# Altium schematic sheet MagneticPowerSwitch.SchDoc: Magnetic Switch Logic
size 431 x 279 mm; DocumentNumber: 3; SheetNumber: 3; SheetTotal: 18; ENG_APP_DATE: --/--/--; DSN_APP_DATE: --/--/--; CHK_APP_DATE: --/--/--
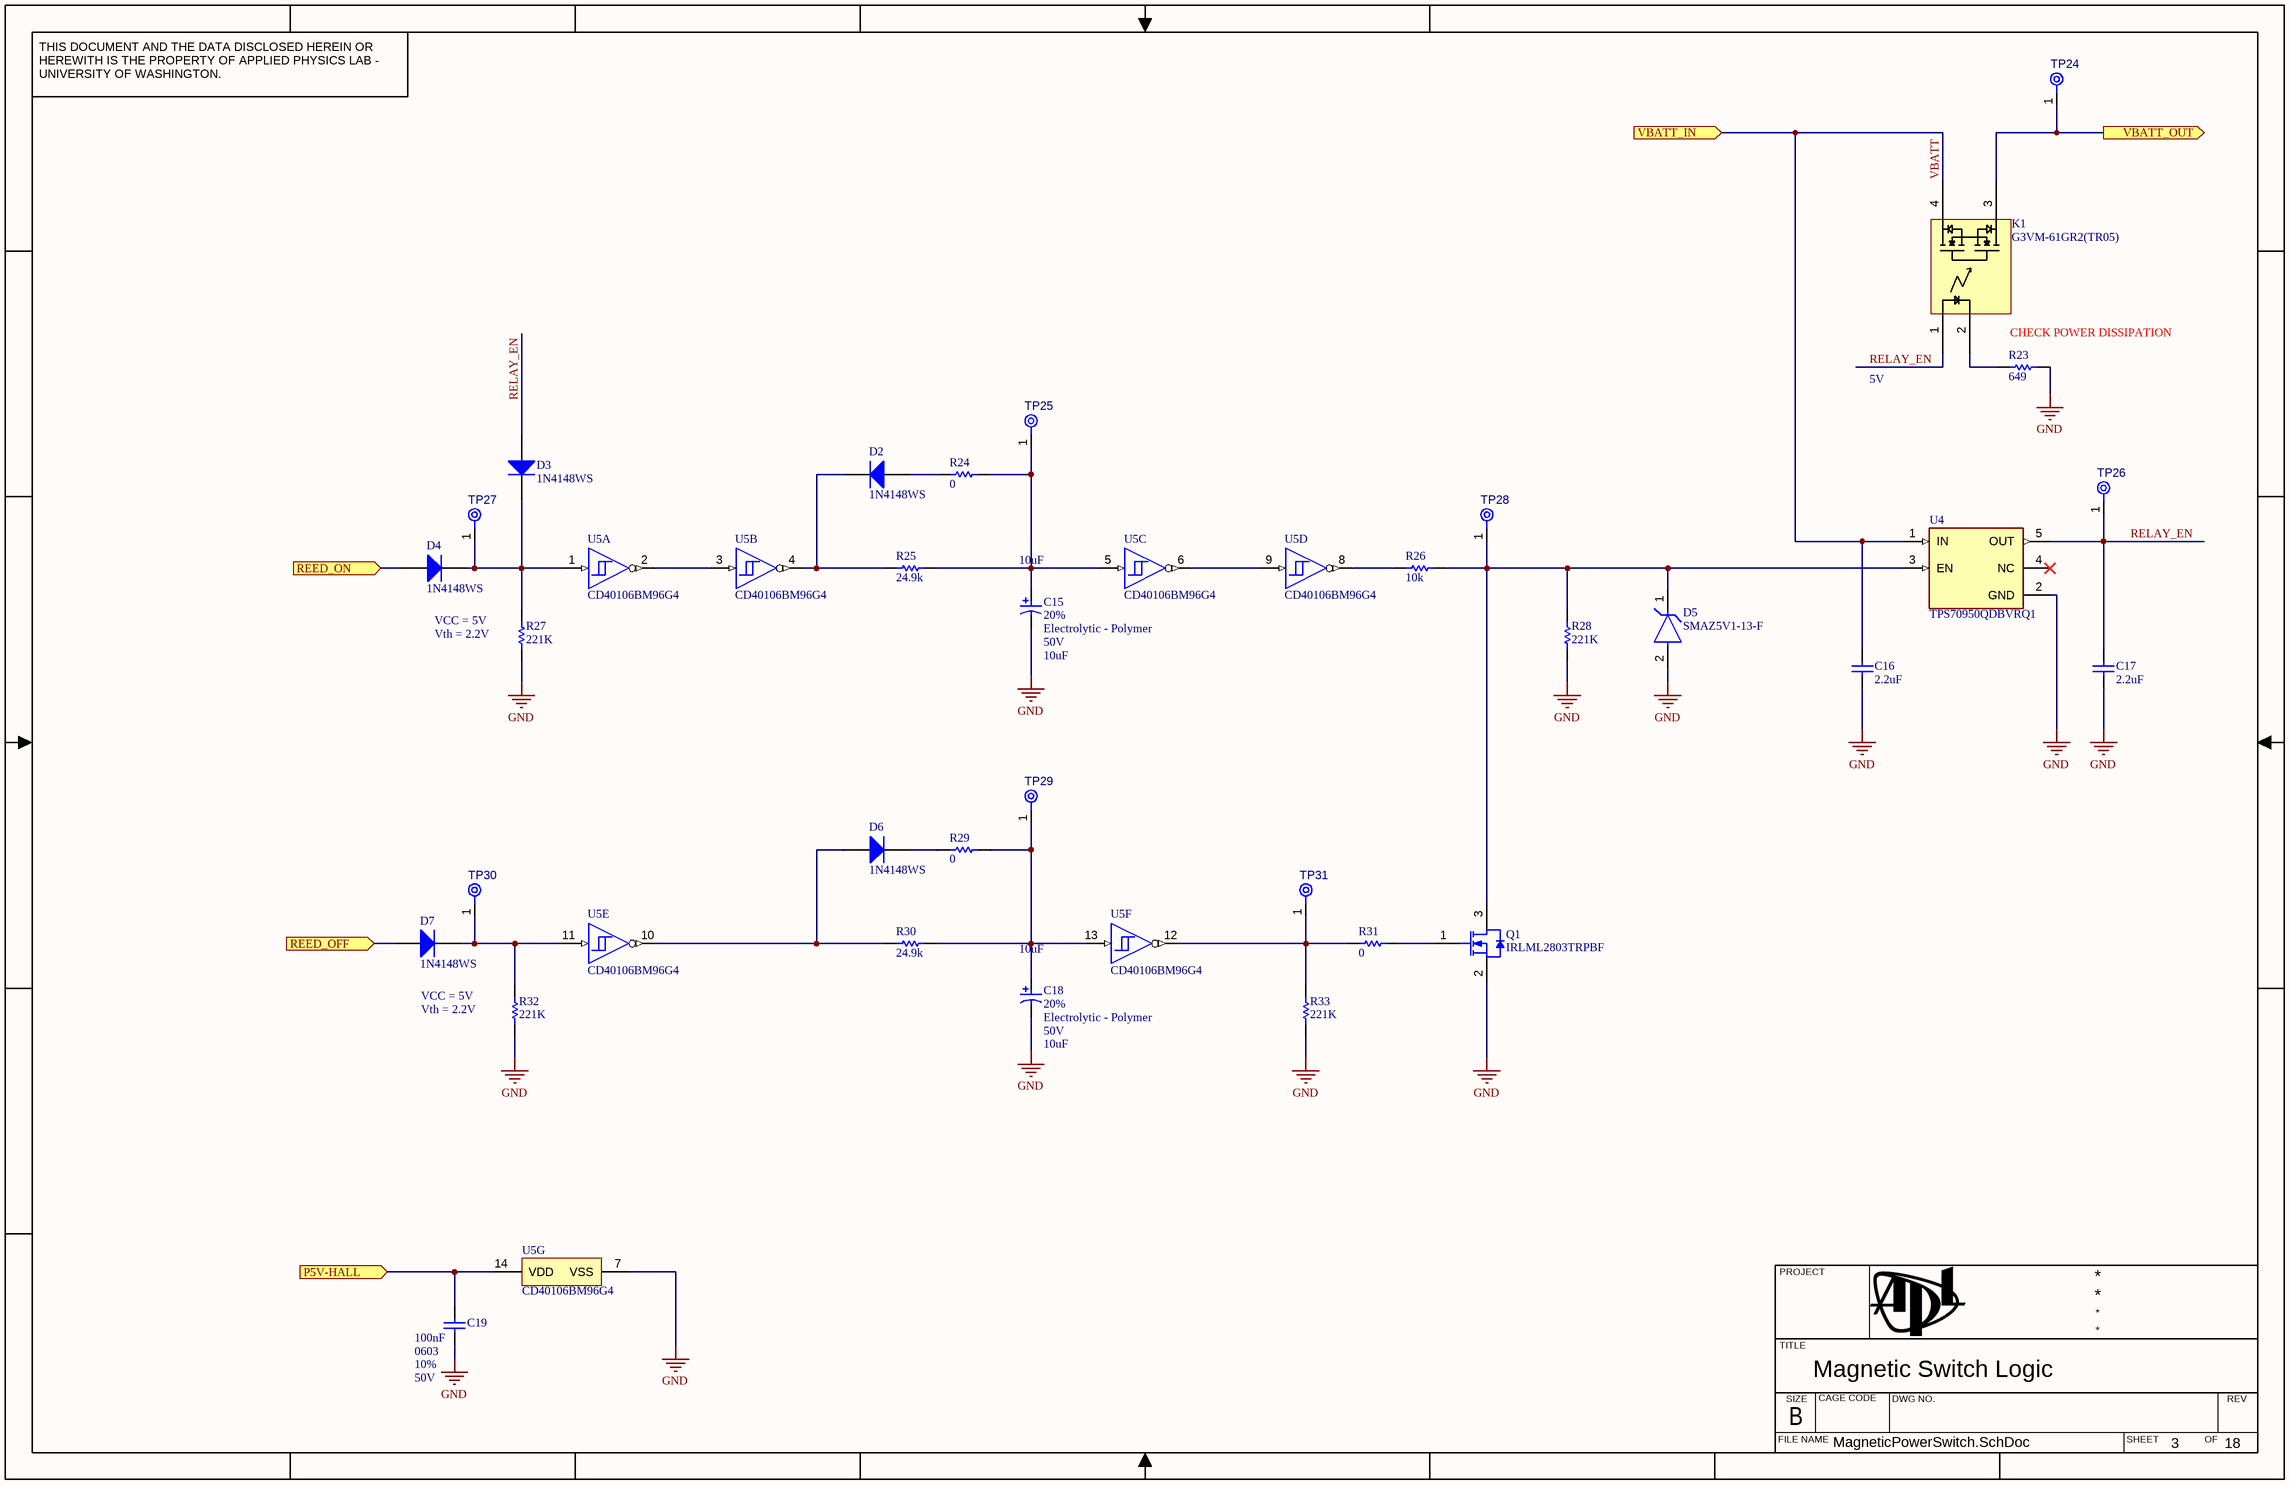
[diagram p0: MagneticPowerSwitch.SchDoc]

## Parts
C15  value 10uF  Tolerance: 20%  Material: Electrolytic - Polymer  Voltage Rating: 50V  Capacitance: 10uF  [CAPAE5953X61M]  (hidden comment: EEH-ZA1H100R)
C16  value 2.2uF  [CAPC3225X270X30ML30]  (hidden comment: Capacitor 2.2uF 10%, 50V, X7R, 1210)
C17  value 2.2uF  [CAPC3225X270X30ML30]  (hidden comment: Capacitor 2.2uF 10%, 50V, X7R, 1210)
C18  value 10uF  Tolerance: 20%  Material: Electrolytic - Polymer  Voltage Rating: 50V  Capacitance: 10uF  [CAPAE5953X61M]  (hidden comment: EEH-ZA1H100R)
C19  value 100nF  Case/Package: 0603  Tolerance: 10%  Voltage Rating: 50V  [CAPC1608X90X40ML10T20]  (hidden comment: Capacitor 100nF +/- 10%, 50V, X7R, 0603)
D2  1N4148WS  [FAIR-SOD-323_V]
D3  1N4148WS  [FAIR-SOD-323_V]
D4  1N4148WS  [FAIR-SOD-323_V]
D5  SMAZ5V1-13-F  [FP-SMA-MFG]
D6  1N4148WS  [FAIR-SOD-323_V]
D7  1N4148WS  [FAIR-SOD-323_V]
K1  G3VM-61GR2(TR05)  [G3VM-61GR2(TR05)-Footprint-1]
Q1  IRLML2803TRPBF  [SOT95P237X112-3M]
R23  value 649  [RESC1609X50X30ML08T20]  (hidden comment: Resistor 649R +/-1% 0603 100 mW)
R24  value 0  [RESC1608X55X25ML10T15]  (hidden comment: Resistor 0R +/- 5% 0603 100 mW)
R25  value 24.9k  [RESC1608X55X25ML10T15]  (hidden comment: Resistor 24K9 +/-1% 0603 100 mW)
R26  value 10k  [RESC1608X55X25ML10T15]  (hidden comment: Resistor 10k +/-1% 0603 100 mW)
R27  value 221K  [RESC1609X50X30ML08T20]  (hidden comment: Resistor 221K +/-1% 0603 100 mW)
R28  value 221K  [RESC1609X50X30ML08T20]  (hidden comment: Resistor 221K +/-1% 0603 100 mW)
R29  value 0  [RESC1608X55X25ML10T15]  (hidden comment: Resistor 0R +/- 5% 0603 100 mW)
R30  value 24.9k  [RESC1608X55X25ML10T15]  (hidden comment: Resistor 24K9 +/-1% 0603 100 mW)
R31  value 0  [RESC1608X55X25ML10T15]  (hidden comment: Resistor 0R +/- 5% 0603 100 mW)
R32  value 221K  [RESC1609X50X30ML08T20]  (hidden comment: Resistor 221K +/-1% 0603 100 mW)
R33  value 221K  [RESC1609X50X30ML08T20]  (hidden comment: Resistor 221K +/-1% 0603 100 mW)
TP24  TPAD6R-CIRCLED  [TP06R - Circled]  (value not drawn)  (no BOM)
TP25  TPAD6R-CIRCLED  [TP06R - Circled]  (value not drawn)  (no BOM)
TP26  TPAD6R-CIRCLED  [TP06R - Circled]  (value not drawn)  (no BOM)
TP27  TPAD6R-CIRCLED  [TP06R - Circled]  (value not drawn)  (no BOM)
TP28  TPAD6R-CIRCLED  [TP06R - Circled]  (value not drawn)  (no BOM)
TP29  TPAD6R-CIRCLED  [TP06R - Circled]  (value not drawn)  (no BOM)
TP30  TPAD6R-CIRCLED  [TP06R - Circled]  (value not drawn)  (no BOM)
TP31  TPAD6R-CIRCLED  [TP06R - Circled]  (value not drawn)  (no BOM)
U4  TPS70950QDBVRQ1  [FP-DBV0005A-IPC_A]
U5  CD40106BM96G4  [D0014A_M]  (parts A,B,C,D,E,F,G of 7)

## Ports
P5V-HALL (in), REED_OFF (in), REED_ON (in), VBATT_IN (in), VBATT_OUT (out)

## Nets
GND: C15.2 C16.1 C17.1 C18.2 C19.1 D5.2(A) Q1.2(S) R23.1 R27.1 R28.1 R32.1 R33.1 U4.2(GND) U5.7(VSS)
P5V-HALL: C19.2 U5.14(VDD) ; port P5V-HALL
REED_OFF: D7.1(A) ; port REED_OFF
REED_ON: D4.1(A) ; port REED_ON
RELAY_EN: C17.2 D3.1(A) K1.1(+_CNTL) TP26.1(TP) U4.5(OUT)
VBATT: C16.2 K1.4(DRAIN) U4.1(IN) ; port VBATT_IN
VBATT_OUT: K1.3(DRAIN) TP24.1(TP) ; port VBATT_OUT
NetC15_1: C15.1 R24.2 R25.2 TP25.1(TP) U5.5(C)
NetC18_1: C18.1 R29.2 R30.2 TP29.1(TP) U5.13(F)
NetD2_1: D2.1(A) R24.1
NetD2_2: D2.2(K) R25.1 U5.4(H=~{B})
NetD3_2: D3.2(K) D4.2(K) R27.2 TP27.1(TP) U5.1(A)
NetD5_1: D5.1(C) Q1.3(D) R26.2 R28.2 TP28.1(TP) U4.3(EN)
NetD6_1: D6.1(A) R30.1 U5.10(K=~{E})
NetD6_2: D6.2(K) R29.1
NetD7_2: D7.2(K) R32.2 TP30.1(TP) U5.11(E)
NetK1_2: K1.2(-_CNTL) R23.2
NetQ1_1: Q1.1(G) R31.2
NetR26_1: R26.1 U5.8(J=~{D})
NetR31_1: R31.1 R33.2 TP31.1(TP) U5.12(L=~{F})
NetU5_2: U5.2(G=~{A}) U5.3(B)
NetU5_6: U5.6(I=~{C}) U5.9(D)

Not connected (* = marked no-connect by the designer): U4 4(NC)*

## Notes on the sheet
- CHECK POWER DISSIPATION
- 5V
- VCC = 5V
- (near R27) Vth = 2.2V
- (near R32) Vth = 2.2V
- THIS DOCUMENT AND THE DATA DISCLOSED HEREIN OR HEREWITH IS THE PROPERTY OF APPLIED PHYSICS LAB - UNIVERSITY OF WASHINGTON.
- PROJECT
- TITLE
- FILE NAME
- SIZE
- B
- CAGE CODE
- DWG NO.
- SHEET
- OF
- REV

## Library data of the parts
C15 C18 = CMP-001-00213-11: Cap Aluminum 10uF 50V 20% (5 X 5.8mm) SMD 0.12 Ohm 750mA 5000 hr 105°C Embossed T/R; Manufacturer: Panasonic; ESR (Equivalent Series Resistance): 120mR; Series: ZA; Min Operating Temperature: -55°C; Max Operating Temperature: 105°C; Mount: Surface Mount; Case/Package: Radial; Decade: 10uF; Ripple Current: 750mA; Part Number: EEH-ZA1H100R
C16 C17 = CMP-001-00182-9: Chip Capacitor, 2.2uF, 10%, 50 V, X7R 1210 (3225 Metric); Decade: 1uF; Capacitor Type: Ceramic; Voltage Rating: 50V; Capacitance: 2.2uF; Max Operating Temperature: 125°C; Pins: 2; Tolerance: 10%; Case/Package: 1210; Min Operating Temperature: -55°C; RoHS Compliant: True; Dielectric: X7R; Mount: Surface Mount
C19 = CMP-001-00206-10: Chip Capacitor, 100nF, +/- 10%, 50 V, X7R 0603 (1608 Metric); Capacitor Type: Ceramic; Dielectric: X7R; Pins: 2; RoHS Compliant: True; Max Operating Temperature: 125°C; Capacitance: 100nF; Min Operating Temperature: -55°C; Decade: 100nF; Mount: Surface Mount
D2-D4 D6 D7 = CMP-004-00001-3: Small Signal Diode, 75 V, 0.15 A, -55 to 150 degC, 2-Pin SOD-323, RoHS, Tape and Reel; Manufacturer: Fairchild; Recovery Time: 4ns; Forward Voltage: 1V; Peak Reverse Current: 5uA; Forward Current: 150mA; Capacitance: -323f; Datasheet URL: https://www.fairchildsemi.com/datasheets/1N/1N4148WS.pdf; Package Reference: SOD-323; Package Description: 2-Pin Small Outline Diode Flat Lead, Body 1.7 x 1.25 mm; Case/Package: SOD-323; Manufacturer URL: https://www.fairchildsemi.com/; Pins: 2; Packaging: TapeandReel; Package Quantity: 3000; Min Operating Temperature: -55°C; RoHS Compliant: True; Max Operating Temperature: 150°C; Datasheet Version: Rev. 1.2, 03/2015; Mount: Surface Mount
D5 = CMP-004-00043-2: Vz=5.1V 4.84V~5.4V Izt=100mA P=1W; Forward Voltage: 1.2V; Impedance: 5; Test Current: 100mA; Zener Voltage: 5.1; Power Rating: 1W; Tolerance: 5%; Element Configuration: Single; Max Reverse Leakage Current: 1uA; Case/Package: SMA; Number of Pins: 2; Height: 2.09mm; Max Operating Temperature: 150°C; Weight: 0.002258oz; Width: 2.92mm; Length: 4.6mm; Min Operating Temperature: -65°C; Voltage Tolerance: 5%; Power Dissipation: 1W; Max Reverse Current: 1uA; Voltage Rating (DC): 5.1; Zener Current: 1uA; Working Voltage: 5.1; Mount: Surface Mount; Max Power Dissipation: 1W; Termination: SMD/SMT
K1 = CMP-008-00015-2: Relay Ssr 25MA 1.48V Dc-in 1.3A 48V Ac/dc-out 4-PIN Sop T/r; On-State Resistance: 130mR; Isolation Voltage: 1.5kV; Load Current: 1.7A; Max Input Voltage: 60V; Min Input Voltage: 0V; Relay Form: SPST-NO; Termination: Gull Wing; Case/Package: SOP; Max Operating Temperature: +85C; Min Operating Temperature: -40C; Mount: Surface Mount
Q1 = CMP-013-00048-3: Mosfet, Power; N-ch; Vdss 30V; Rds(on) 0.25 Ohm; Id 1.2A; MICRO3; Pd 540MW; Vgs +/-20V; Manufacturer: International Rectifier; Threshold Voltage: 1V; Rds On Max: 250mR; Gate to Source Voltage (Vgs): 20V; Transistor Type: NMOS; Max Power Dissipation: 540mW; Case/Package: SOT-23; Min Operating Temperature: -55°C; Drain to Source Breakdown Voltage: 30V; Max Operating Temperature: 150°C; Mount: Surface Mount
R23 = CMP-009-00771-5: Chip Resistor, 649 Ohm, +/- 1%, 0.1 W, -55 to 155 degC, 0603 (1608 Metric); Voltage Rating: 75V; Power: 100mW; Decade: 100; Pins: 2; RoHS Compliant: Yes; Max Operating Temperature: 155°C; Case/Package: 0603; Min Operating Temperature: -55°C; Tolerance: 1%; Mount: Surface Mount
R24 R29 R31 = CMP-009-00006-7: Chip Resistor, 0 Ohm, 0.1 W, -55 to 155 degC, 0603 (1608 Metric); Voltage Rating: 50V; Power: 100mW; RoHS Compliant: True; Max Operating Temperature: 155°C; Tolerance: 5%; Min Operating Temperature: -55°C; Case/Package: 0603; Pins: 2; Mount: Surface Mount; Decade: 0
R25 R30 = CMP-009-00972-4: Chip Resistor, 24.9k Ohm, +/- 1%, 0.1 W, -55 to 155 degC, 0603 (1608 Metric); Power: 100mW; Decade: 10k; Voltage Rating: 75V; RoHS Compliant: True; Tolerance: 1%; Case/Package: 0603; Min Operating Temperature: -55°C; Max Operating Temperature: 155°C; Pins: 2; Mount: Surface Mount
R26 = CMP-009-00017-8: Chip Resistor, 10 KOhm, +/- 1%, 01 W, -55 to 155 degC, 0603 (1608 Metric); Voltage Rating: 50V; Power: 100mW; Min Operating Temperature: -55°C; Case/Package: 0603; Tolerance: 1%; Max Operating Temperature: 155°C; RoHS Compliant: True; Pins: 2; Decade: 10k; Mount: Surface Mount
R27 R28 R32 R33 = CMP-009-00908-2: Chip Resistor, 221k Ohm, +/- 1%, 0.1 W, -55 to 155 degC, 0603 (1608 Metric); Decade: 100k; Voltage Rating: 75V; Power: 100mW; Pins: 2; Case/Package: 0603; Min Operating Temperature: -55°C; RoHS Compliant: Yes; Max Operating Temperature: 155°C; Tolerance: 1%; Mount: Surface Mount
TP24-TP31 = CMP-00028-00014-3: 0.6mm round with a silkscreen circle.; Pins: 1
U4 = CMP-019-00075-3: LDO Regulator Pos 5V 0.15A 5-Pin SOT-23 T/R; Max Input Voltage: 30V; Regulator Type: Linear; Polarity: Positive; Max Output Current: 150mA; Dropout Voltage: 690mV; Isolation: No; Min Input Voltage: 2.7V; Max Operating Temperature: 125°C; Min Operating Temperature: -40°C; Case/Package: SOT-23-5; Switching Frequency: N/A; Output Voltage: 5V; Isolation Voltage: N/A; Mount: Surface Mount
U5 = CMP-016-00020-4: 6-ch, 3-V to 18-V inverters with Schmitt-Trigger inputs 14-SOIC -55 to 125; Max Supply Voltage: 18V; Logic Function: Buffer,Inverter,Schmitt Trigger; Elements: 6; Min Supply Voltage: 3V; Max Operating Temperature: 125°C; Case/Package: 14-SOIC; Min Operating Temperature: -55°C; Mount: Surface Mount